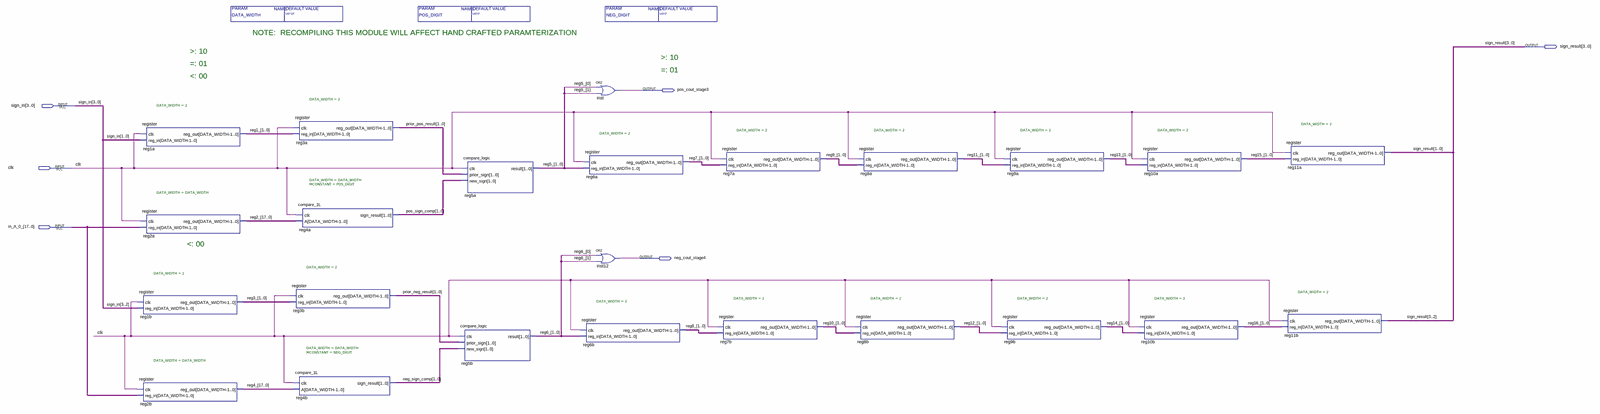
[diagram p0: schematic sheet, whole]
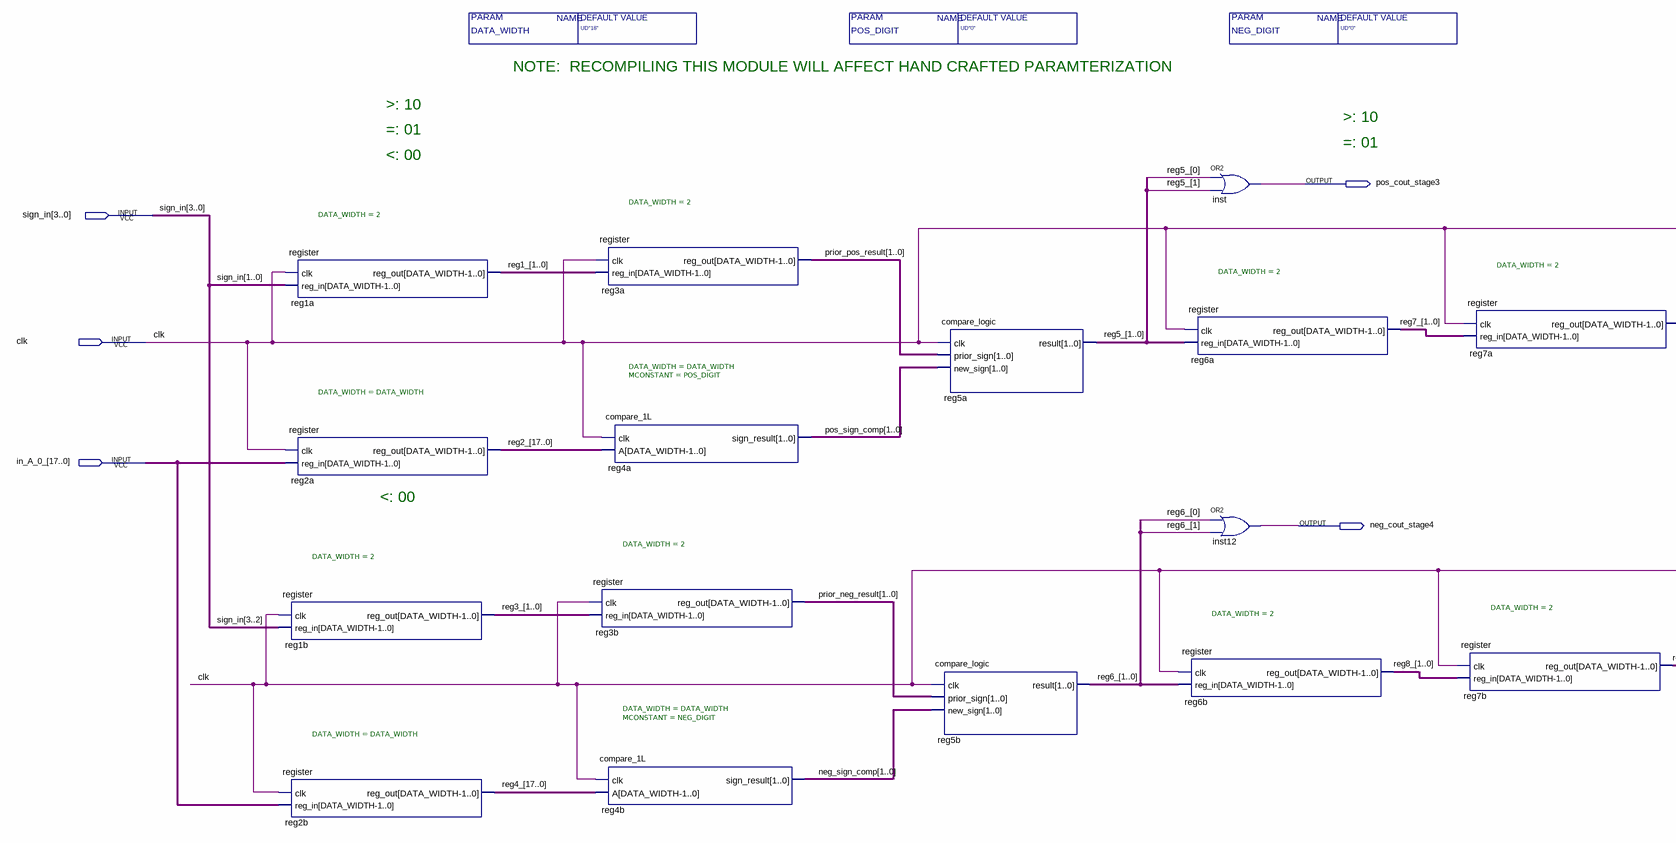
[diagram p1: schematic sheet, left part]
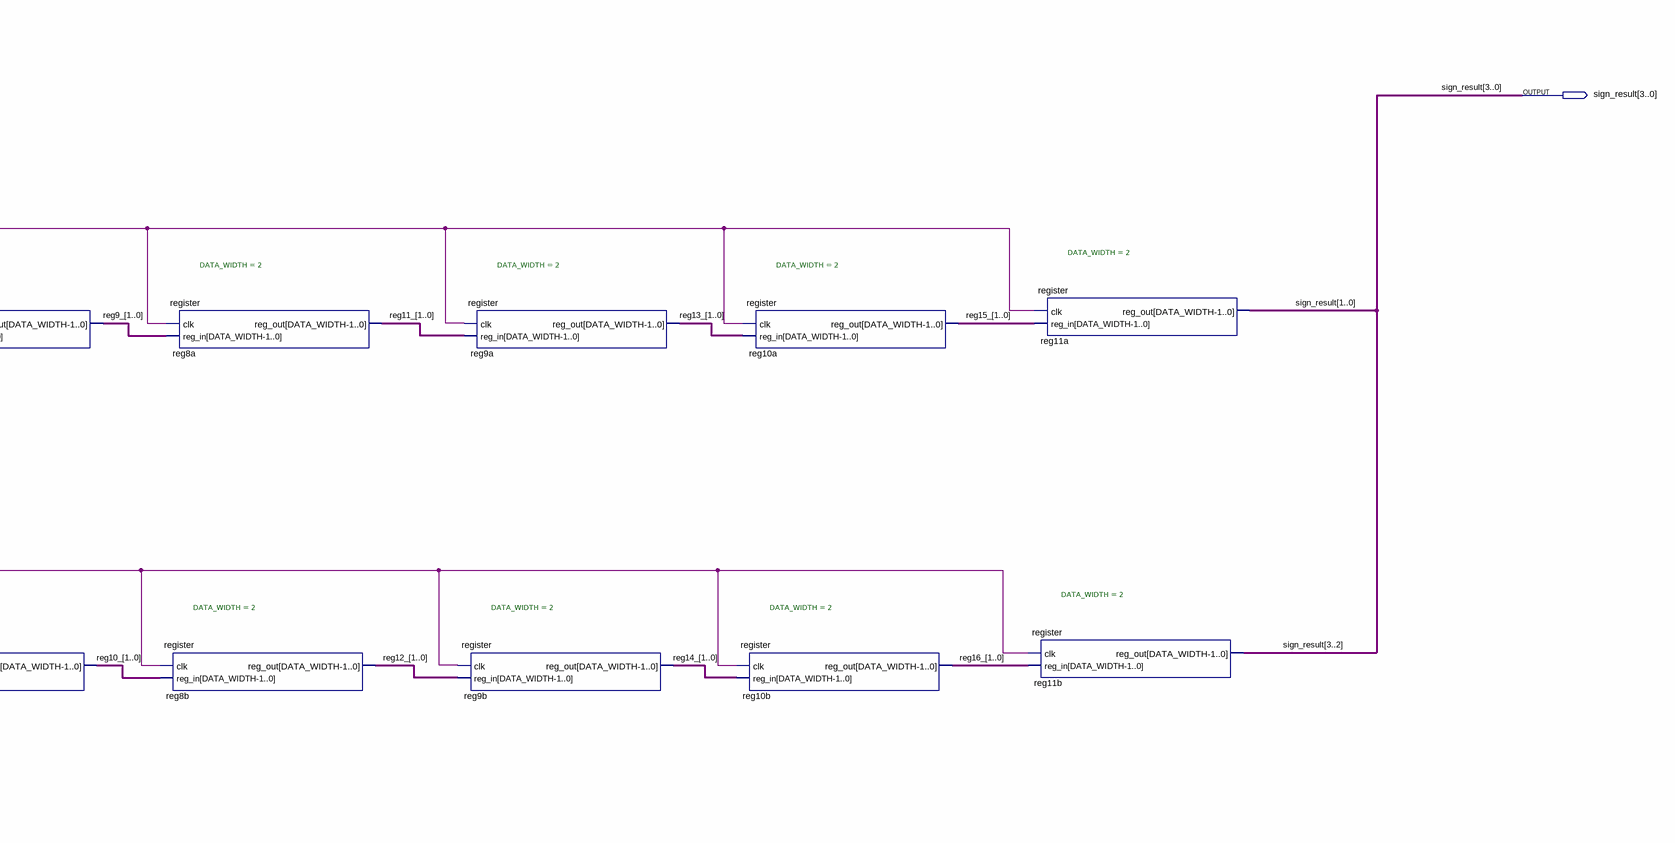
[diagram p2: schematic sheet, right part]
// Quartus schematic ModDualCmp_9L_mlab.bdf as structural Verilog: 24 symbols, 6 pins
module ModDualCmp_9L_mlab #(parameter DATA_WIDTH = "UD\"18\"", parameter POS_DIGIT = "UD\"0\"", parameter NEG_DIGIT = "UD\"0\"") (
  input  [3:0] sign_in,
  input  clk,
  input  [17:0] in_A_0_,
  output [3:0] sign_result,
  output pos_cout_stage3,
  output neg_cout_stage4
);

  wire [1:0] neg_sign_comp, pos_sign_comp, prior_neg_result, prior_pos_result, reg1_, reg3_, reg5_, reg6_,
       reg7_, reg8_, reg9_, reg10_, reg11_, reg12_, reg13_, reg14_, reg15_, reg16_;
  wire [17:0] reg2_, reg4_;

  register #(.DATA_WIDTH(2)) reg1a (.clk(clk), .reg_in(sign_in[1:0]), .reg_out(reg1_));
  register #(.DATA_WIDTH(DATA_WIDTH)) reg2a (.clk(clk), .reg_in(in_A_0_), .reg_out(reg2_));
  register #(.DATA_WIDTH(2)) reg1b (.clk(clk), .reg_in(sign_in[3:2]), .reg_out(reg3_));
  register #(.DATA_WIDTH(DATA_WIDTH)) reg2b (.clk(clk), .reg_in(in_A_0_), .reg_out(reg4_));
  register #(.DATA_WIDTH(2)) reg3a (.clk(clk), .reg_in(reg1_), .reg_out(prior_pos_result));
  compare_1L #(.DATA_WIDTH(DATA_WIDTH), .MCONSTANT(POS_DIGIT)) reg4a (
    .clk(clk), .A(reg2_), .sign_result(pos_sign_comp));
  register #(.DATA_WIDTH(2)) reg3b (.clk(clk), .reg_in(reg3_), .reg_out(prior_neg_result));
  compare_1L #(.DATA_WIDTH(DATA_WIDTH), .MCONSTANT(NEG_DIGIT)) reg4b (
    .clk(clk), .A(reg4_), .sign_result(neg_sign_comp));
  compare_logic reg5a (.clk(clk), .prior_sign(prior_pos_result), .new_sign(pos_sign_comp), .result(reg5_));
  compare_logic reg5b (.clk(clk), .prior_sign(prior_neg_result), .new_sign(neg_sign_comp), .result(reg6_));
  or inst (pos_cout_stage3, reg5_[0], reg5_[1]);
  register #(.DATA_WIDTH(2)) reg6a (.clk(clk), .reg_in(reg5_), .reg_out(reg7_));
  or inst12 (neg_cout_stage4, reg6_[0], reg6_[1]);
  register #(.DATA_WIDTH(2)) reg6b (.clk(clk), .reg_in(reg6_), .reg_out(reg8_));
  register #(.DATA_WIDTH(2)) reg7a (.clk(clk), .reg_in(reg7_), .reg_out(reg9_));
  register #(.DATA_WIDTH(2)) reg7b (.clk(clk), .reg_in(reg8_), .reg_out(reg10_));
  register #(.DATA_WIDTH(2)) reg8a (.clk(clk), .reg_in(reg9_), .reg_out(reg11_));
  register #(.DATA_WIDTH(2)) reg8b (.clk(clk), .reg_in(reg10_), .reg_out(reg12_));
  register #(.DATA_WIDTH(2)) reg9a (.clk(clk), .reg_in(reg11_), .reg_out(reg13_));
  register #(.DATA_WIDTH(2)) reg9b (.clk(clk), .reg_in(reg12_), .reg_out(reg14_));
  register #(.DATA_WIDTH(2)) reg10a (.clk(clk), .reg_in(reg13_), .reg_out(reg15_));
  register #(.DATA_WIDTH(2)) reg10b (.clk(clk), .reg_in(reg14_), .reg_out(reg16_));
  register #(.DATA_WIDTH(2)) reg11a (.clk(clk), .reg_in(reg15_), .reg_out(sign_result[1:0]));
  register #(.DATA_WIDTH(2)) reg11b (.clk(clk), .reg_in(reg16_), .reg_out(sign_result[3:2]));

  // Notes on the sheet:
  //   NOTE:  RECOMPILING THIS MODULE WILL AFFECT HAND CRAFTED PARAMTERIZATION
  //   >: 10
  //   >: 10
  //   =: 01
  //   =: 01
  //   <: 00
  //   <: 00
endmodule
